# EAGLE design 555_blinkblink (EAGLE 5.11)
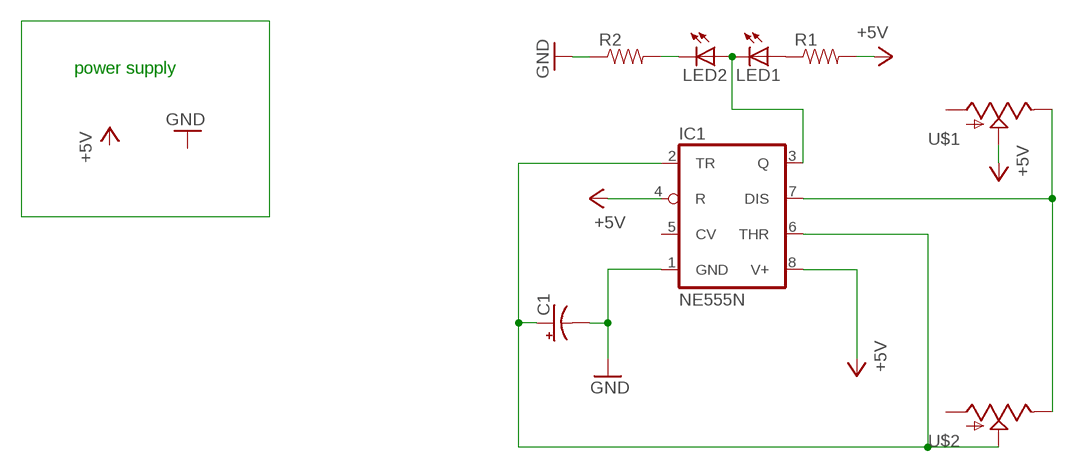
[diagram p0: schematic, sheet 1]

## Parts
C1  CAP_POLPTH1  [CPOL-RADIAL-100UF-25V]
IC1  NE555N  [DIL08-ROUND]
LED1  LED5MM  [LED5MM]
LED2  LED5MM  [LED5MM]
R1  RESISTORAXIAL-0.3  [AXIAL-0.3]
R2  RESISTORAXIAL-0.3  [AXIAL-0.3]
U$1  POT  [ALPS_POT]
U$2  POT  [ALPS_POT]

## Nets
+5V: IC1.4(R) IC1.8(V+) R1.P$2 U$1.P$2(S)
GND: C1.2(-) IC1.1(GND) R2.P$1
N$2: IC1.3(Q) LED1.K(C) LED2.A
N$3: LED1.A R1.P$1
N$4: LED2.K(C) R2.P$2
N$5: IC1.7(DIS) U$1.P$1(E) U$2.P$1(E)
N$6: C1.1(+) IC1.2(TR) IC1.6(THR) U$2.P$2(S)
Unconnected: IC1.5(CV) U$1.P$3(A) U$2.P$3(A)

## Notes on the sheet
- power supply

## Library data of the parts
C1 = SparkFun:CAP_POL: Capacitor Polarized These are standard SMD and PTH capacitors. Normally 10uF, 47uF, and 100uF in electrolytic and tantalum varieties. Always verify the external diameter of the through hole cap, it varies with capacity, voltage, and manufacturer. The EIA devices should be standard.
IC1 = adafruit:*555: TIMER Changed DIP package to have round (not oval) pin pads http://www.ladyada.net/library/pcb/eaglelibrary.html
LED1 LED2 = adafruit:LED: LED OSRAM: - CHIPLED LG R971, LG N971, LY N971, LG Q971, LY Q971, LO R971, LY R971 LH N974, LH R974 LS Q976, LO Q976, LY Q976 LO Q996 - Hyper CHIPLED LW Q18S LB Q993, LB Q99A, LB R99A - SideLED LS A670, LO A670, LY A670, LG A670, LP A670 LB A673, LV A673, LT A673, LW A673 LH A674 LY A675 LS A676, LA A676, LO A676, LY A676, LW A676 LS A679, LY A679, LG A679 - Hyper Micro SIDELED® LS Y876, LA Y876, LO Y876, LY Y876 LT Y87S - SmartLED LW L88C, LW L88S LB L89C, LB L89S, LG L890 LS L89K, LO L89K, LY L89K LS L896, LA L896, LO L896, LY L896 - TOPLED LS T670, LO T670, LY T670, LG T670, LP T670 LSG T670, LSP T670, LSY T670, LOP T670, LYG T670 LG T671, LOG T671, LSG T671 LB T673, LV T673, LT T673, LW T673 LH T674 LS T676, LA T676, LO T676, LY T676, LB T676, LH T676, LSB T676, LW T676 LB T67C, LV T67C, LT T67C, LS T67K, LO T67K, LY T67K, LW E67C LS E67B, LA E67B, LO E67B, LY E67B, LB E67C, LV E67C, LT E67C LW T67C LS T679, LY T679, LG T679 LS T770, LO T770, LY T770, LG T770, LP T770 LB T773, LV T773, LT T773, LW T773 LH T774 LS E675, LA E675, LY E675, LS T675 LS T776, LA T776, LO T776, LY T776, LB T776 LHGB T686 LT T68C, LB T68C - Hyper Mini TOPLED® LB M676 - Mini TOPLED Santana® LG M470 LS M47K, LO M47K, LY M47K Source: http://www.osram.convergy.de/
R1 R2 = SparkFun:RESISTOR: Resistor Basic schematic elements and footprints for 0603, 1206, and PTH resistors.
U$1 U$2 = SparkFun:POT

## Board
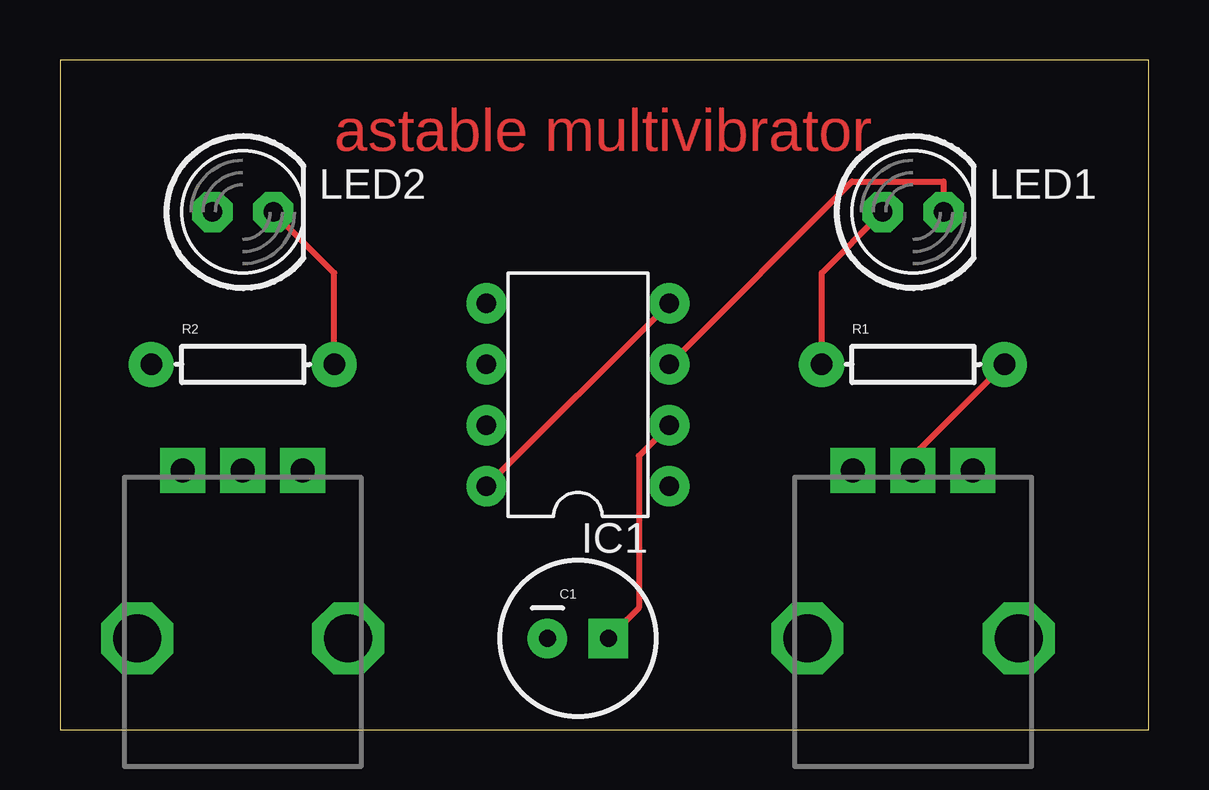
[diagram p1: board, top side]
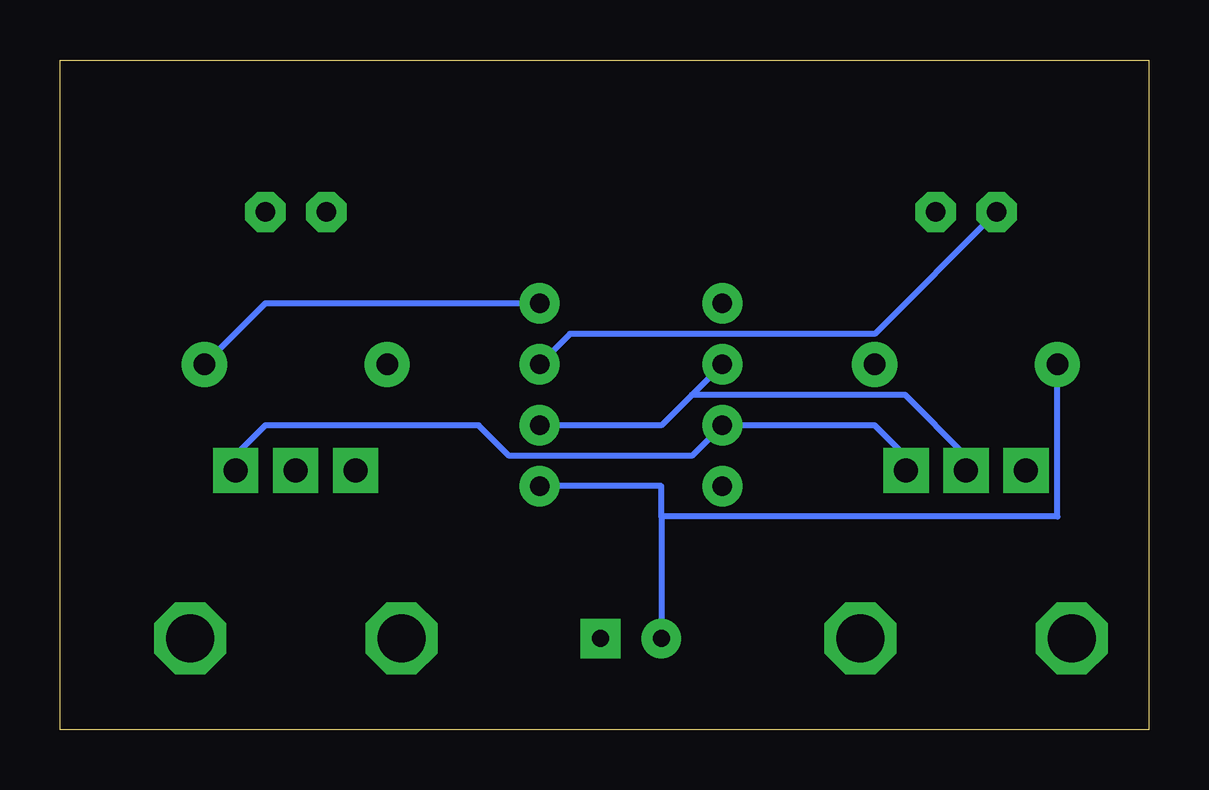
[diagram p2: board, bottom side, seen from below]

Size 45.39 x 27.93 mm. Coordinates in mm from the lower left corner, seen from the top.
Outline: 0,0 45.39,0 45.39,27.93 0,27.93 0,0
Copper layers (1*16): Top 0.035mm / dielectric 1.5mm / Bottom 0.035mm
Design rules "default": minimum track width 10mil, minimum drill 24mil, track to track 8mil, track to pad 8mil, pad to pad 8mil, via to via 8mil, smd to smd 8mil, copper to edge 40mil, drill to drill 8mil, minimum pad ring 10mil, minimum via ring 8mil, stop-mask expansion 4mil, vias tented up to drill 0mil, thermal gap 10mil

### Footprints (pad centres in the part's own frame; a part is rotated, then mirrored left to right if it is on the bottom)
CPOL-RADIAL-100UF-25V = drill 0.7 pad 1.651 square: 1 1.27,0 | drill 0.7 pad 1.651 round: 2 -1.27,0
DIL08-ROUND = drill 0.813 pad 1.676 round: 1 -3.81,-3.81; 2 -1.27,-3.81; 3 1.27,-3.81; 4 3.81,-3.81; 5 3.81,3.81; 6 1.27,3.81; 7 -1.27,3.81; 8 -3.81,3.81
LED5MM = drill 0.813 pad 1.676 octagon: A -1.27,0; K 1.27,0
AXIAL-0.3 = drill 0.9 pad 1.88 round: P$1 -3.81,0; P$2 3.81,0
ALPS_POT = drill 1 pad 1.88 square: P$1 7,-2.5; P$2 7,0; P$3 7,2.5 | drill 2 octagon: P$4 0,-4.4; P$5 0,4.4

### Placement (x,y rotation side)
C1  21.59,3.81 0 top
IC1  21.59,13.97 90 top
LED1  35.56,21.59 0 top
LED2  7.62,21.59 0 top
R1  35.56,15.24 0 top
R2  7.62,15.24 0 top
U$1  35.56,3.81 90 top
U$2  7.62,3.81 90 top

### Tracks (layer width: path | path; a pad name or v marks a point on that pad's centre or on a via)
+5V
  Top 0.254: R1.P$2 35.56,11.43 U$1.P$2 | IC1.8 IC1.4
  Bottom 0.254: R1.P$2 36.83,17.78 IC1.4
GND
  Bottom 0.254: 20.32,8.89 20.32,10.16 IC1.1 | 20.32,8.89 C1.2 | R2.P$1 3.81,8.89 20.32,8.89
N$2
  Top 0.254: IC1.3 33.02,22.86 36.83,22.86 LED1.K
  Bottom 0.254: LED2.A 11.43,16.51 24.13,16.51 IC1.3
N$3
  Top 0.254: LED1.A 31.75,19.05 R1.P$1
N$4
  Top 0.254: LED2.K 11.43,19.05 R2.P$2
N$5
  Bottom 0.254: U$1.P$1 38.1,11.43 36.83,12.7 27.94,12.7 26.67,11.43 19.05,11.43 IC1.7 11.43,12.7 10.16,11.43 U$2.P$1
N$6
  Top 0.254: C1.1 24.13,5.08 24.13,11.43 IC1.2
  Bottom 0.254: 19.05,13.97 20.32,12.7 IC1.2 | 19.05,13.97 IC1.6 | 19.05,13.97 10.16,13.97 7.62,11.43 U$2.P$2

### Text on the board
Top: astable multivibrator